# Altium schematic sheet Sheet1.SchDoc
size A4
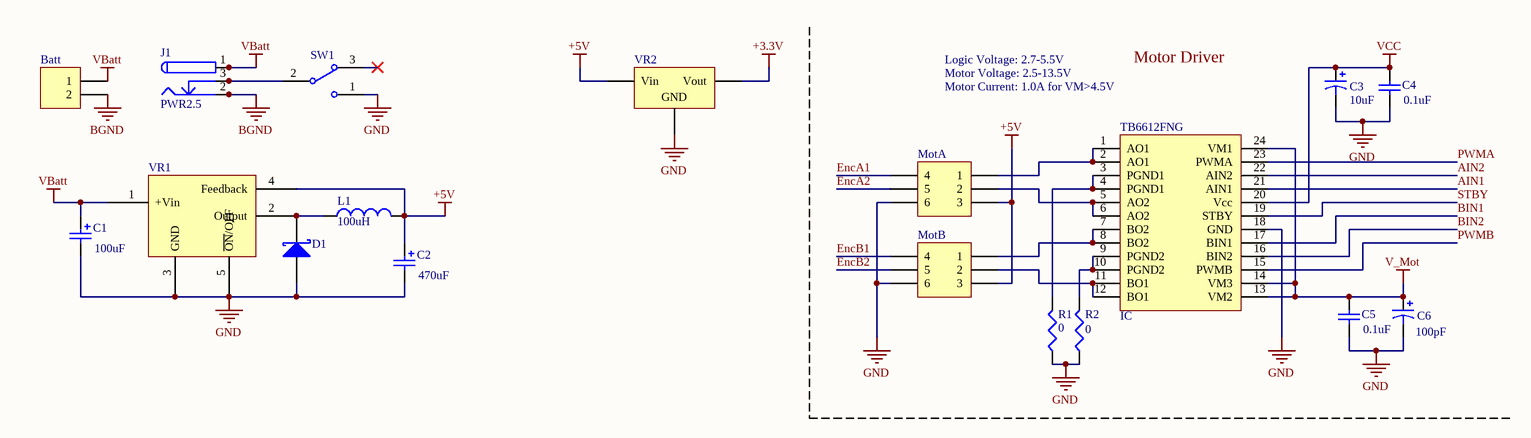
[diagram p0: Sheet1.SchDoc]

## Parts
Batt  Header 2  [HDR1X2]  (value not drawn)
C1  value 100uF  [Capacitor]  (hidden comment: Cap Pol2)
C2  value 470uF  [Capacitor - 8x10.5]  (hidden comment: Cap Pol2)
C3  value 10uF  [C0805]  (hidden comment: Cap Pol3)
C4  value 0.1uF  [C1206]  (hidden comment: Cap Semi)
C5  value 0.1uF  [C1206]  (hidden comment: Cap Semi)
C6  value 100pF  [C0805]  (hidden comment: Cap Pol3)
D1  D Schottky  [SMB]  (value not drawn)
J1  PWR2.5  [KLD-0202]
L1  value 100uH  [0402-A]  (hidden comment: Inductor)
MotA  Header 3X2A  [HDR2X3_CEN]  (value not drawn)
MotB  Header 3X2A  [HDR2X3_CEN]  (value not drawn)
R1  value 0  [J1-0603]  (hidden comment: Shunt Resistor)
R2  value 0  [J1-0603]  (hidden comment: Shunt Resistor)
SW1  SW-SPDT  [TL36WW15050]  (value not drawn)
TB6612FNG  IC
VR1  LM2576S-5.0NOPB  [LM2576S]  (value not drawn)
VR2  3V Volt Reg  [D2PAK_N]  (value not drawn)

## Nets
+3.3V: VR2.3(Vout)
+5V: C2.1 L1.2 MotA.3 MotB.3 VR1.4(Feedback) VR2.1(Vin)
BGND: Batt.2 J1.2 J1.2A J1.2B
GND: C1.2 C2.2 C3.2 C4.2 C5.2 C6.2 D1.1(A) MotA.6 MotB.6 R1.1 R2.1 SW1.1 TB6612FNG.18(GND) VR1.3(GND) VR1.5(~{ON}/OFF) VR2.2(GND)
V_Mot: C5.1 C6.1 TB6612FNG.13(VM2) TB6612FNG.14(VM3) TB6612FNG.24(VM1)
VBatt: Batt.1 C1.1 J1.1 J1.1A J1.1B VR1.1(+Vin)
VCC: C3.1 C4.1 TB6612FNG.20(Vcc)
AIN1: TB6612FNG.21(AIN1)
AIN2: TB6612FNG.22(AIN2)
BIN1: TB6612FNG.17(BIN1)
BIN2: TB6612FNG.16(BIN2)
EncA1: MotA.4
EncA2: MotA.5
EncB1: MotB.4
EncB2: MotB.5
PWMA: TB6612FNG.23(PWMA)
PWMB: TB6612FNG.15(PWMB)
STBY: TB6612FNG.19(STBY)
NetD1_2: D1.2(K) L1.1 VR1.2(Output)
NetJ1_3: J1.3 J1.3A J1.3B SW1.2
NetMotA_1: MotA.1 TB6612FNG.1(AO1) TB6612FNG.2(AO1)
NetMotA_2: MotA.2 TB6612FNG.5(AO2) TB6612FNG.6(AO2)
NetMotB_1: MotB.1 TB6612FNG.7(BO2) TB6612FNG.8(BO2)
NetMotB_2: MotB.2 TB6612FNG.11(BO1) TB6612FNG.12(BO1)
NetR1_2: R1.2 TB6612FNG.3(PGND1) TB6612FNG.4(PGND1)
NetR2_2: R2.2 TB6612FNG.9(PGND2) TB6612FNG.10(PGND2)

Not connected (* = marked no-connect by the designer): SW1 3*

## Notes on the sheet
- Logic Voltage: 2.7-5.5V
- Motor Voltage: 2.5-13.5V
- Motor Current: 1.0A for VM>4.5V
- Motor Driver

## Library data of the parts
Batt = Header 2: Header, 2-Pin; LatestRevisionDate: 17-Jul-2002; LatestRevisionNote: Re-released for DXP Platform.; Publisher: Altium Limited
C1 C2 = Cap Pol2: Polarized Capacitor (Radial); Published: 8-Jun-2000; LatestRevisionDate: 17-Jul-2002; LatestRevisionNote: Re-released for DXP Platform.; PackageReference: POLAR0.8; Publisher: Altium Limited; PackageDescription: Polarized Capacitor; 2 Leads
C3 C6 = Cap Pol3: Polarized Capacitor (Surface Mount); Published: 8-Jun-2000; LatestRevisionDate: 29-May-2009; LatestRevisionNote: IPC-7351 Footprint Added.; PackageReference: C0805; Publisher: Altium Limited; PackageDescription: Chip Capacitor
C4 C5 = Cap Semi: Capacitor (Semiconductor SIM Model); Published: 8-Jun-2000; LatestRevisionDate: 29-May-2009; LatestRevisionNote: IPC-7351 Footprint Added.; PackageReference: C1206; Publisher: Altium Limited; PackageDescription: Chip Capacitor
D1 = D Schottky: Schottky Diode; Published: 8-Jun-2000; LatestRevisionDate: 17-Jul-2002; LatestRevisionNote: Re-released for DXP Platform.; PackageReference: SMB; Publisher: Altium Limited; PackageDescription: DO-214-AA/SMB; 2 C-Bend Leads; Body 5.3 x 3.6 mm, inc. leads (LxW); Code_JEDEC: DO-214-AA
J1 = PWR2.5: Low Voltage Power Supply Connector; Published: 17-Dec-2003; DatasheetDocument: 09-May-2002; Publisher: Altium Limited; ComponentLink1Description: Manufacturer Link; ComponentLink1URL: http://domino.kycon.com/internet/Products.html
L1 = Inductor: Code_IEC: 1005; Published: 8-Jun-2000; LatestRevisionDate: 29-May-2009; LatestRevisionNote: IPC-7351 Footprint Added.; PackageReference: 0402-A; Publisher: Altium Limited; PackageDescription: Chip Inductor; Code_JEITA: 0402
MotA MotB = Header 3X2A: Header, 3-Pin, Dual row; LatestRevisionDate: 17-Jul-2002; LatestRevisionNote: Re-released for DXP Platform.; Publisher: Altium Limited
R1 R2 = Res3: Resistor; Published: 8-Jun-2000; LatestRevisionDate: 29-May-2009; LatestRevisionNote: IPC-7351 Footprint Added.; PackageReference: J1-0603; Publisher: Altium Limited; PackageDescription: Chip Resistor
SW1 = SW-SPDT: SPDT Subminiature Toggle Switch, Right Angle Mounting, Vertical Actuation; Published: 24-Mar-1999; LatestRevisionDate: 17-Dec-2003; LatestRevisionNote: Schematic revised, PCB Footprint replaced.; DatasheetVersion: 05-Dec-2000; PackageReference: TL36WW15050; Publisher: Altium Limited; PackageDescription: Switch; 4 Leads; ComponentLink1Description: Manufacturer Link; ComponentLink1URL: http://www.apem.com
TB6612FNG = TB6612FNG IC: Motor Driver IC
VR1 = LM2576S-5.0NOPB: 5V Switching Regulator
VR2 = Volt Reg: Voltage Regulator; Published: 24-Mar-1999; LatestRevisionDate: 29-May-2009; LatestRevisionNote: IPC-7351 Footprint Added.; PackageReference: D2PAK; Publisher: Altium Limited; PackageDescription: 3-Pin Transistor Outline Package 2.54 mm Pitch, 15.1 mm Lead Span